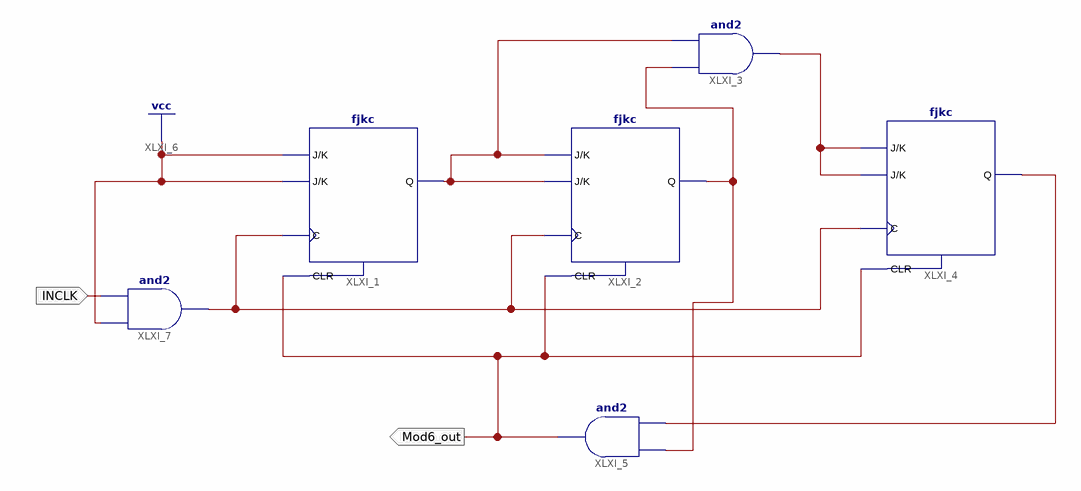
[diagram p0: schematic sheet 1]
// Xilinx ISE schematic Mod6.sch (spartan6) as structural Verilog: 6 symbols, 2 ports
module Mod6 (
  input  INCLK,
  output Mod6_out
);

  wire XLXN_2, XLXN_3, XLXN_7, XLXN_9, XLXN_13;

  fjkc XLXI_1 (.C(XLXN_7), .CLR(Mod6_out), .J(1'b1), .K(1'b1), .Q(XLXN_13));
  fjkc XLXI_2 (.C(XLXN_7), .CLR(Mod6_out), .J(XLXN_13), .K(XLXN_13), .Q(XLXN_2));
  and XLXI_3 (XLXN_3, XLXN_2, XLXN_13);
  fjkc XLXI_4 (.C(XLXN_7), .CLR(Mod6_out), .J(XLXN_3), .K(XLXN_3), .Q(XLXN_9));
  and XLXI_5 (Mod6_out, XLXN_9, XLXN_2);
  and XLXI_7 (XLXN_7, 1'b1, INCLK);
endmodule
